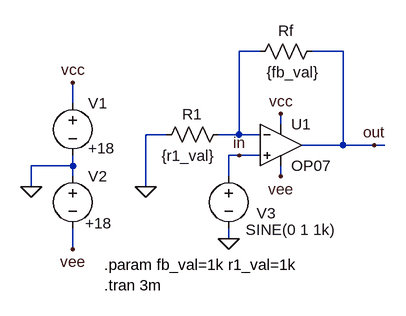
[diagram p0: schematic 07-non_inverting_amplifier.asc]
07-non_inverting_amplifier.asc, the LTspice schematic file:
Version 4
SHEET 1 880 680
WIRE 160 -64 128 -64
WIRE 288 -64 240 -64
WIRE -128 16 -128 -16
WIRE 192 48 192 32
WIRE 16 64 -16 64
WIRE 128 64 128 -64
WIRE 128 64 96 64
WIRE 160 64 128 64
WIRE 288 80 288 -64
WIRE 288 80 224 80
WIRE 336 80 288 80
WIRE 352 80 336 80
WIRE 128 96 112 96
WIRE 160 96 128 96
WIRE -128 112 -128 96
WIRE -128 112 -192 112
WIRE -128 128 -128 112
WIRE 112 128 112 96
WIRE 192 128 192 112
WIRE -192 144 -192 112
WIRE -16 144 -16 64
WIRE 112 224 112 208
WIRE -128 240 -128 208
FLAG -192 144 0
FLAG -128 -16 vcc
FLAG -128 240 vee
FLAG -16 144 0
FLAG 128 96 in
FLAG 192 128 vee
FLAG 192 32 vcc
FLAG 336 80 out
FLAG 112 224 0
SYMBOL OpAmps\\OP07 192 16 R0
SYMATTR InstName U1
SYMBOL voltage -128 0 R0
WINDOW 3 24 85 Left 2
WINDOW 123 0 0 Left 0
WINDOW 39 0 0 Left 0
SYMATTR Value +18
SYMATTR InstName V1
SYMBOL voltage -128 112 R0
WINDOW 3 19 88 Left 2
WINDOW 123 0 0 Left 0
WINDOW 39 0 0 Left 0
SYMATTR Value +18
SYMATTR InstName V2
SYMBOL voltage 112 112 R0
WINDOW 0 43 73 Left 2
WINDOW 3 26 98 Left 2
WINDOW 123 0 0 Left 0
WINDOW 39 0 0 Left 0
SYMATTR InstName V3
SYMATTR Value SINE(0 1 1k)
SYMBOL res 256 -80 R90
WINDOW 0 0 56 VBottom 2
WINDOW 3 32 45 VTop 2
SYMATTR InstName Rf
SYMATTR Value {fb_val}
SYMBOL res 112 48 R90
WINDOW 0 0 56 VBottom 2
WINDOW 3 33 62 VTop 2
SYMATTR InstName R1
SYMATTR Value {r1_val}
TEXT -80 264 Left 2 !.param fb_val=1k r1_val=1k
TEXT -80 296 Left 2 !.tran 3m

The netlist it stands for:
* 07-non_inverting_amplifier.asc
XU1 in N001 vcc vee out LT1001  ; OP07, pins In+ In- V+ V- OUT
V1 vcc 0 +18
V2 0 vee +18
V3 in 0 SINE(0 1 1k)
Rf out N001 {fb_val}
R1 N001 0 {r1_val}
.param fb_val=1k r1_val=1k
.tran 3m
.lib LTC.lib
.backanno
.end

* Results of the author's LTspice run, read from the files saved beside the schematic
* Operating Point, zero values left out:
*   V(vcc) = 18 V
*   V(vee) = -18 V
*   I(V1) = -2.25 mA
*   I(V2) = -2.25 mA
*   Ix(u1:3) = 2.25 mA
*   Ix(u1:4) = -2.25 mA
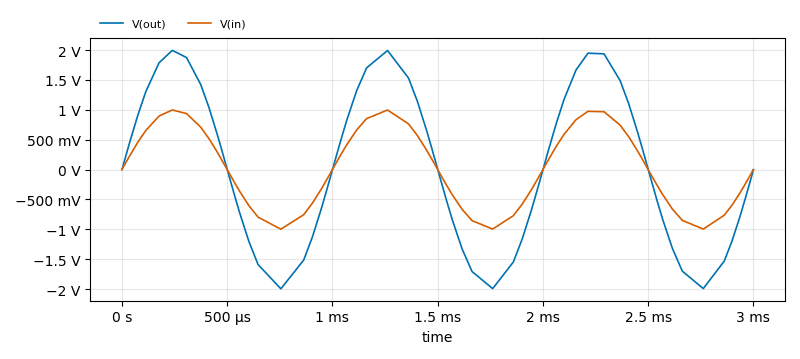
[diagram p1: Transient Analysis of 07-non_inverting_amplifier.asc, plotted from the saved traces]
* Transient Analysis, 1 run:
*   V(out): min -1.996 V, max 1.995 V, average 4.953 mV, rms 1.392 V, last -4.767 mV
*   V(in): min -998.2 mV, max 997.8 mV, average 2.476 mV, rms 695.9 mV, last 0 V